# Altium schematic sheet RF SHIELD.SchDoc
size A4; SheetNumber: 5; SheetTotal: 5
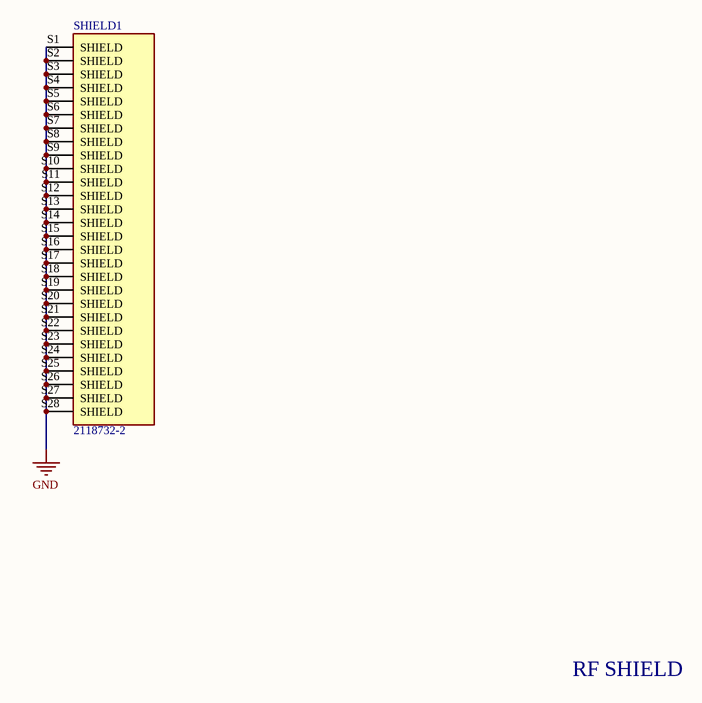
[diagram p0: RF SHIELD.SchDoc]

## Parts
SHIELD1  2118732-2  [TE_2118732-2]

## Nets
GND: SHIELD1.S1(SHIELD) SHIELD1.S2(SHIELD) SHIELD1.S3(SHIELD) SHIELD1.S4(SHIELD) SHIELD1.S5(SHIELD) SHIELD1.S6(SHIELD) SHIELD1.S7(SHIELD) SHIELD1.S8(SHIELD) SHIELD1.S9(SHIELD) SHIELD1.S10(SHIELD) SHIELD1.S11(SHIELD) SHIELD1.S12(SHIELD) SHIELD1.S13(SHIELD) SHIELD1.S14(SHIELD) SHIELD1.S15(SHIELD) SHIELD1.S16(SHIELD) SHIELD1.S17(SHIELD) SHIELD1.S18(SHIELD) SHIELD1.S19(SHIELD) SHIELD1.S20(SHIELD) SHIELD1.S21(SHIELD) SHIELD1.S22(SHIELD) SHIELD1.S23(SHIELD) SHIELD1.S24(SHIELD) SHIELD1.S25(SHIELD) SHIELD1.S26(SHIELD) SHIELD1.S27(SHIELD) SHIELD1.S28(SHIELD)

## Notes on the sheet
- RF SHIELD

## Library data of the parts
SHIELD1 = 2118732-2: EMI Filters; Board Level Shielding (BLS); STD SHIELD FRAME; CRS-50.80X38.10X5.08MM; MF: TE Connectivity; DigiKey-Purchase-URL: https://snapeda.com/shop?store=DigiKey&id=1493072; Availability: Warning; Package: None; MP: 2118732-2; Value: *; Mouser-Purchase-URL: https://snapeda.com/shop?store=Mouser&id=1493072; SnapEDA_Link: https://www.snapeda.com/parts/2118732-2/TE%20Connectivity%20AMP%20Connectors/view-part/1493072/?ref=snap; Price: None